# EAGLE schematic LDR-2 (EAGLE 7.2.0)
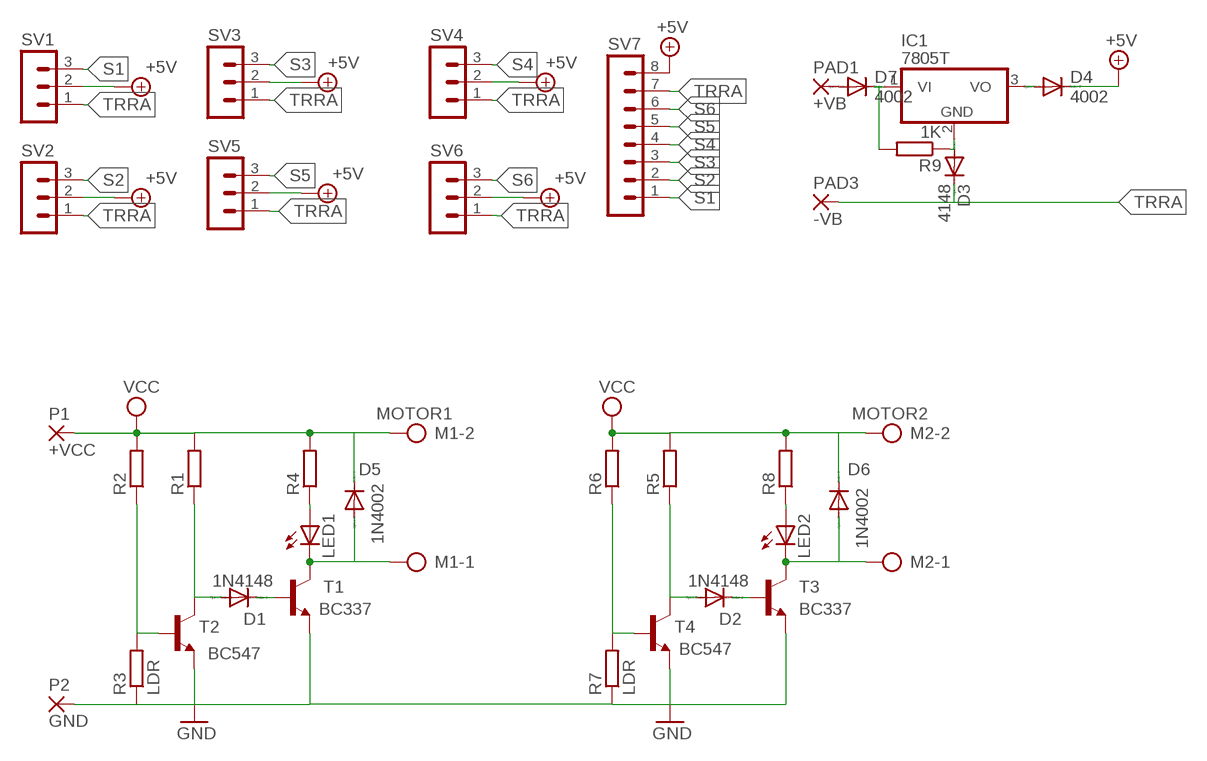
[diagram p0: schematic, sheet 1]

## Parts
D1  1N4148  1N4148DO35-7  [DO35-7]
D2  1N4148  1N4148DO35-7  [DO35-7]
D3  4148  1N4148DO35-7  [DO35-7]
D4  4002  1N4148DO35-7  [DO35-7]
D5  1N4002  1N4933  [DO41-10]
D6  1N4002  1N4933  [DO41-10]
D7  4002  1N4148DO35-7  [DO35-7]
IC1  7805T  [TO220H]
LED1  LED3MM  [LED3MM]
LED2  LED3MM  [LED3MM]
M1  MOTOR1  AK500/2  [AK500/2]
M2  MOTOR2  AK500/2  [AK500/2]
P1  +VCC  WIREPAD2,15/1,0  [2,15/1,0]
P2  GND  WIREPAD2,15/1,0  [2,15/1,0]
PAD1  +VB  WIREPAD1,6/0,9  [1,6/0,9]
PAD3  -VB  WIREPAD1,6/0,9  [1,6/0,9]
R1  R-EU_0207/7  [0207/7]
R2  R-EU_0207/7  [0207/7]
R3  LDR  R-EU_0204/5  [0204/5]
R4  R-EU_0207/7  [0207/7]
R5  R-EU_0207/7  [0207/7]
R6  R-EU_0207/7  [0207/7]
R7  LDR  R-EU_0204/5  [0204/5]
R8  R-EU_0207/7  [0207/7]
R9  1K  R-EU_0207/7  [0207/7]
SV1  MA03-1  [MA03-1]
SV2  MA03-1  [MA03-1]
SV3  MA03-1  [MA03-1]
SV4  MA03-1  [MA03-1]
SV5  MA03-1  [MA03-1]
SV6  MA03-1  [MA03-1]
SV7  MA08-1  [MA08-1]
T1  BC337  BC337-25-NPN-TO92-CBE  [TO92-CBE]
T2  BC547  BC547-NPN-TO92-CBE  [TO92-CBE]
T3  BC337  BC337-25-NPN-TO92-CBE  [TO92-CBE]
T4  BC547  BC547-NPN-TO92-CBE  [TO92-CBE]

## Nets
+5V: D4.C SV1.2 SV2.2 SV3.2 SV4.2 SV5.2 SV6.2 SV7.8
GND: P2.1(P) R3.1 R7.1 T1.E T2.E T3.E T4.E
N$1: D1.C T1.B
N$2: D1.A R1.1 T2.C
N$3: D5.A LED1.K(C) M1.1 T1.C
N$4: D3.A IC1.2(GND) R9.1
N$5: LED1.A R4.1
N$6: R2.1 R3.2 T2.B
N$7: D2.C T3.B
N$8: D2.A R5.1 T4.C
N$9: D6.A LED2.K(C) M2.1 T3.C
N$10: D4.A IC1.3(VO)
N$11: R6.1 R7.2 T4.B
N$12: LED2.A R8.1
N$13: D7.C IC1.1(VI) R9.2
N$18: D7.A PAD1.1(P)
S1: SV1.3 SV7.1
S2: SV2.3 SV7.2
S3: SV3.3 SV7.3
S4: SV4.3 SV7.4
S5: SV5.3 SV7.5
S6: SV6.3 SV7.6
TRRA: D3.C PAD3.1(P) SV1.1 SV2.1 SV3.1 SV4.1 SV5.1 SV6.1 SV7.7
VCC: D5.C D6.C M1.2 M2.2 P1.1(P) R1.2 R2.2 R4.2 R5.2 R6.2 R8.2

## Library data of the parts
D1-D4 D7 = diode:1N4148: DIODE high speed (Philips)
D5 D6 = diode:1N4933: DIODE fast recovery rectifier, 1A
IC1 = linear:78*: Positive VOLTAGE REGULATOR Source: http://cache.national.com/ds/LM/LM78L05.pdf http://www.fairchildsemi.com/ds/LM/LM7805.pdf
LED1 LED2 = led:LED: LED OSRAM: - CHIPLED LG R971, LG N971, LY N971, LG Q971, LY Q971, LO R971, LY R971 LH N974, LH R974 LS Q976, LO Q976, LY Q976 LO Q996 - Hyper CHIPLED LW Q18S LB Q993, LB Q99A, LB R99A - SideLED LS A670, LO A670, LY A670, LG A670, LP A670 LB A673, LV A673, LT A673, LW A673 LH A674 LY A675 LS A676, LA A676, LO A676, LY A676, LW A676 LS A679, LY A679, LG A679 - Hyper Micro SIDELED® LS Y876, LA Y876, LO Y876, LY Y876 LT Y87S - SmartLED LW L88C, LW L88S LB L89C, LB L89S, LG L890 LS L89K, LO L89K, LY L89K LS L896, LA L896, LO L896, LY L896 - TOPLED LS T670, LO T670, LY T670, LG T670, LP T670 LSG T670, LSP T670, LSY T670, LOP T670, LYG T670 LG T671, LOG T671, LSG T671 LB T673, LV T673, LT T673, LW T673 LH T674 LS T676, LA T676, LO T676, LY T676, LB T676, LH T676, LSB T676, LW T676 LB T67C, LV T67C, LT T67C, LS T67K, LO T67K, LY T67K, LW E67C LS E67B, LA E67B, LO E67B, LY E67B, LB E67C, LV E67C, LT E67C LW T67C LS T679, LY T679, LG T679 LS T770, LO T770, LY T770, LG T770, LP T770 LB T773, LV T773, LT T773, LW T773 LH T774 LS E675, LA E675, LY E675, LS T675 LS T776, LA T776, LO T776, LY T776, LB T776 LHGB T686 LT T68C, LB T68C - Hyper Mini TOPLED® LB M676 - Mini TOPLED Santana® LG M470 LS M47K, LO M47K, LY M47K Source: http://www.osram.convergy.de LUXEON: - LUMILED® LXK2-PW12-R00, LXK2-PW12-S00, LXK2-PW14-U00, LXK2-PW14-V00 LXK2-PM12-R00, LXK2-PM12-S00, LXK2-PM14-U00 LXK2-PE12-Q00, LXK2-PE12-R00, LXK2-PE12-S00, LXK2-PE14-T00, LXK2-PE14-U00 LXK2-PB12-K00, LXK2-PB12-L00, LXK2-PB12-M00, LXK2-PB14-N00, LXK2-PB14-P00, LXK2-PB14-Q00 LXK2-PR12-L00, LXK2-PR12-M00, LXK2-PR14-Q00, LXK2-PR14-R00 LXK2-PD12-Q00, LXK2-PD12-R00, LXK2-PD12-S00 LXK2-PH12-R00, LXK2-PH12-S00 LXK2-PL12-P00, LXK2-PL12-Q00, LXK2-PL12-R00 Source: www.luxeon.com KINGBRIGHT: KA-3528ASYC Source: www.kingbright.com
M1 M2 = con-ptr500:AK500/2: CONNECTOR; OC_FARNELL: unknown; OC_NEWARK: unknown
P1 P2 PAD1 PAD3 = wirepad:WIREPAD: Wire PAD connect wire on PCB
R1-R9 = resistor:R-EU_: RESISTOR, European symbol
SV1-SV6 = con-lstb:MA03-1: PIN HEADER; OC_FARNELL: unknown; OC_NEWARK: unknown
SV7 = con-lstb:MA08-1: PIN HEADER; OC_FARNELL: unknown; OC_NEWARK: unknown
T1-T4 = transistor:*-NPN-: NPN Transistror BF959 corrected 2008.03.06